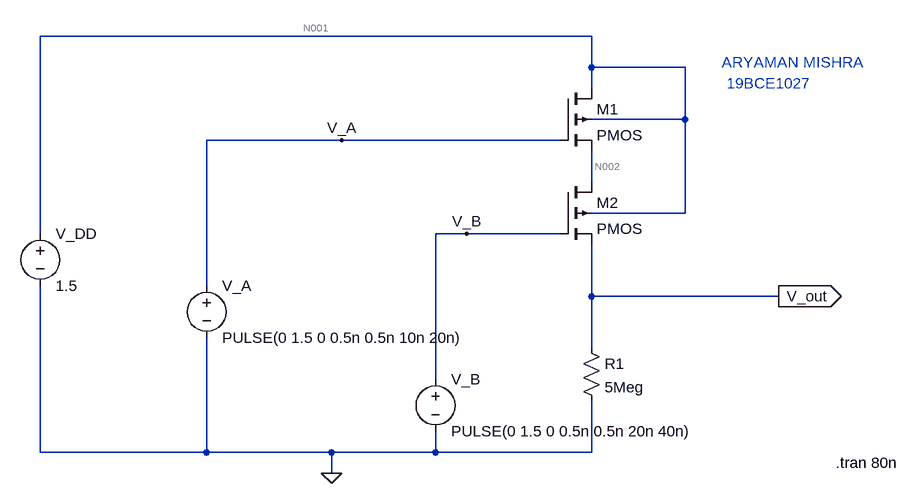
[diagram p0: schematic exp7_task3_2.asc]
exp7_task3_2.asc, the LTspice schematic file:
Version 4
SHEET 1 880 680
WIRE 352 -176 -496 -176
WIRE 352 -128 352 -176
WIRE 496 -128 352 -128
WIRE 352 -96 352 -128
WIRE 496 -48 496 -128
WIRE 496 -48 352 -48
WIRE -32 -16 -240 -16
WIRE 304 -16 -32 -16
WIRE 352 48 352 0
WIRE 496 96 496 -48
WIRE 496 96 352 96
WIRE -496 128 -496 -176
WIRE 160 128 112 128
WIRE 304 128 160 128
WIRE -240 208 -240 -16
WIRE 352 224 352 144
WIRE 640 224 352 224
WIRE 352 304 352 224
WIRE 112 352 112 128
WIRE -496 464 -496 208
WIRE -240 464 -240 288
WIRE -240 464 -496 464
WIRE -48 464 -240 464
WIRE 112 464 112 432
WIRE 112 464 -48 464
WIRE 352 464 352 384
WIRE 352 464 112 464
WIRE -48 496 -48 464
FLAG 640 224 V_out
IOPIN 640 224 Out
FLAG -48 496 0
FLAG -32 -16 V_A
FLAG 160 128 V_B
SYMBOL voltage -496 112 R0
WINDOW 123 0 0 Left 0
WINDOW 39 0 0 Left 0
SYMATTR InstName V_DD
SYMATTR Value 1.5
SYMBOL voltage -240 192 R0
WINDOW 123 0 0 Left 0
WINDOW 39 0 0 Left 0
SYMATTR InstName V_A
SYMATTR Value PULSE(0 1.5 0 0.5n 0.5n 10n 20n)
SYMBOL voltage 112 336 R0
WINDOW 123 0 0 Left 0
WINDOW 39 0 0 Left 0
SYMATTR InstName V_B
SYMATTR Value PULSE(0 1.5 0 0.5n 0.5n 20n 40n)
SYMBOL pmos4 304 -96 R0
SYMATTR InstName M1
SYMBOL pmos4 304 48 R0
SYMATTR InstName M2
SYMBOL res 336 288 R0
SYMATTR InstName R1
SYMATTR Value 5Meg
TEXT 728 480 Left 2 !.tran 80n
TEXT 560 -104 Left 2 ;19BCE1027
TEXT 552 -136 Left 2 ;ARYAMAN MISHRA

The netlist it stands for:
* exp7_task3_2.asc
V_DD N001 0 1.5
V_A V_A 0 PULSE(0 1.5 0 0.5n 0.5n 10n 20n)
V_B V_B 0 PULSE(0 1.5 0 0.5n 0.5n 20n 40n)
M1 N001 V_A N002 N001 PMOS
M2 N002 V_B V_out N001 PMOS
R1 V_out 0 5Meg
.model NMOS NMOS
.model PMOS PMOS
.lib standard.mos
.tran 80n
* 19BCE1027
* ARYAMAN MISHRA
.backanno
.end

* Results of the author's LTspice run, read from the files saved beside the schematic
* Operating Point, zero values left out:
*   V(n001) = 1.5 V
*   V(n002) = 1.49 V
*   V(v_out) = 1.48 V
*   Id(M2) = 296 nA
*   Is(M2) = -296 nA
*   Id(M1) = 296 nA
*   Is(M1) = -296 nA
*   I(R1) = 296 nA
*   I(V_dd) = -296 nA
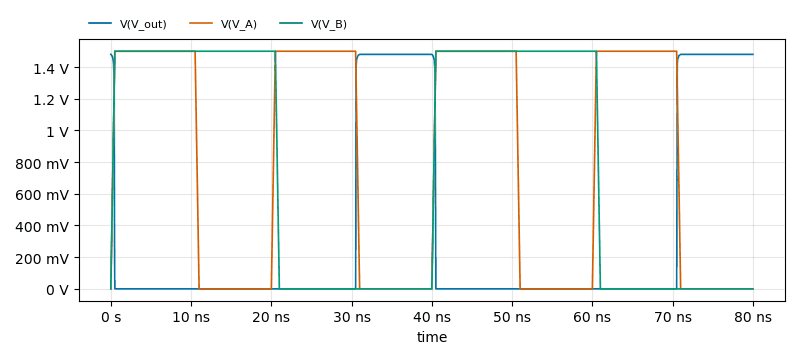
[diagram p1: Transient Analysis of exp7_task3_2.asc, plotted from the saved traces]
* Transient Analysis, 1 run:
*   V(V_out): min 13.2 µV, max 1.48 V, average 366 mV, rms 734.7 mV, last 1.48 V
*   V(V_A): min 0 V, max 1.5 V, average 787.5 mV, rms 1.081 V, last 0 V
*   V(V_B): min 0 V, max 1.5 V, average 768.7 mV, rms 1.07 V, last 0 V